# EAGLE schematic Principal_PCB (EAGLE 8.2.2)
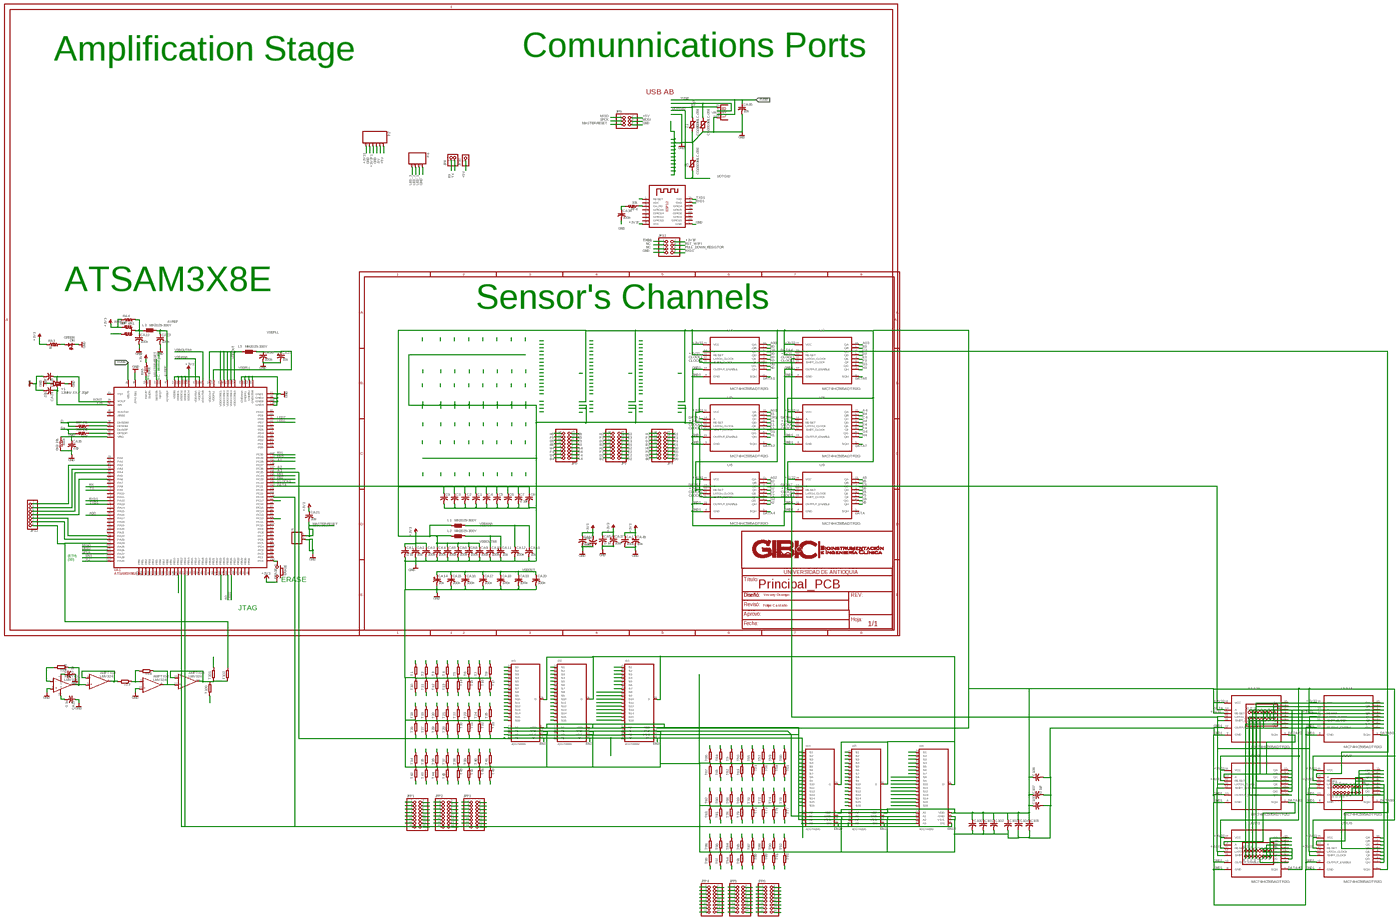
[diagram p0: schematic, sheet 1, overview]
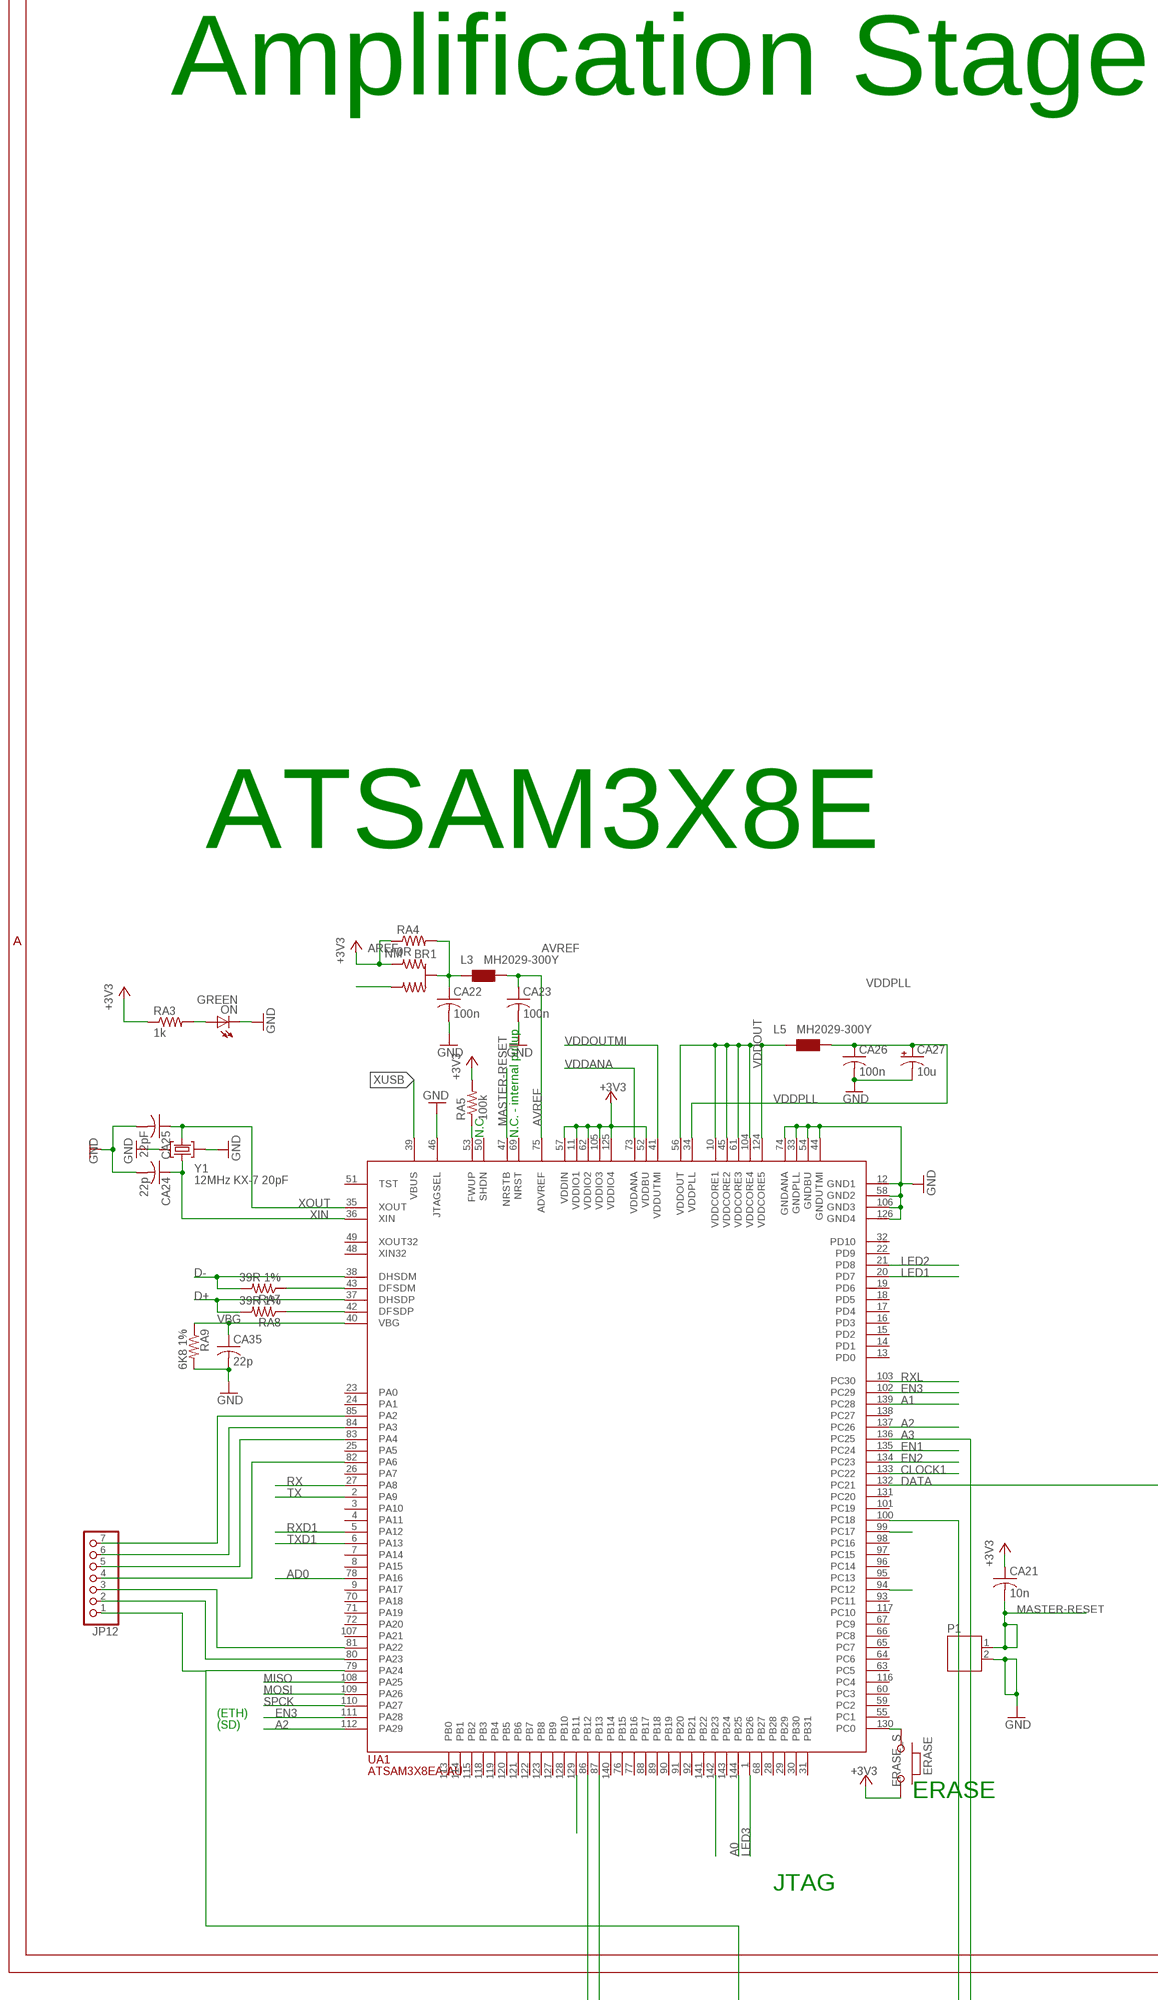
[diagram p1: schematic, sheet 1, part 1 of 6]
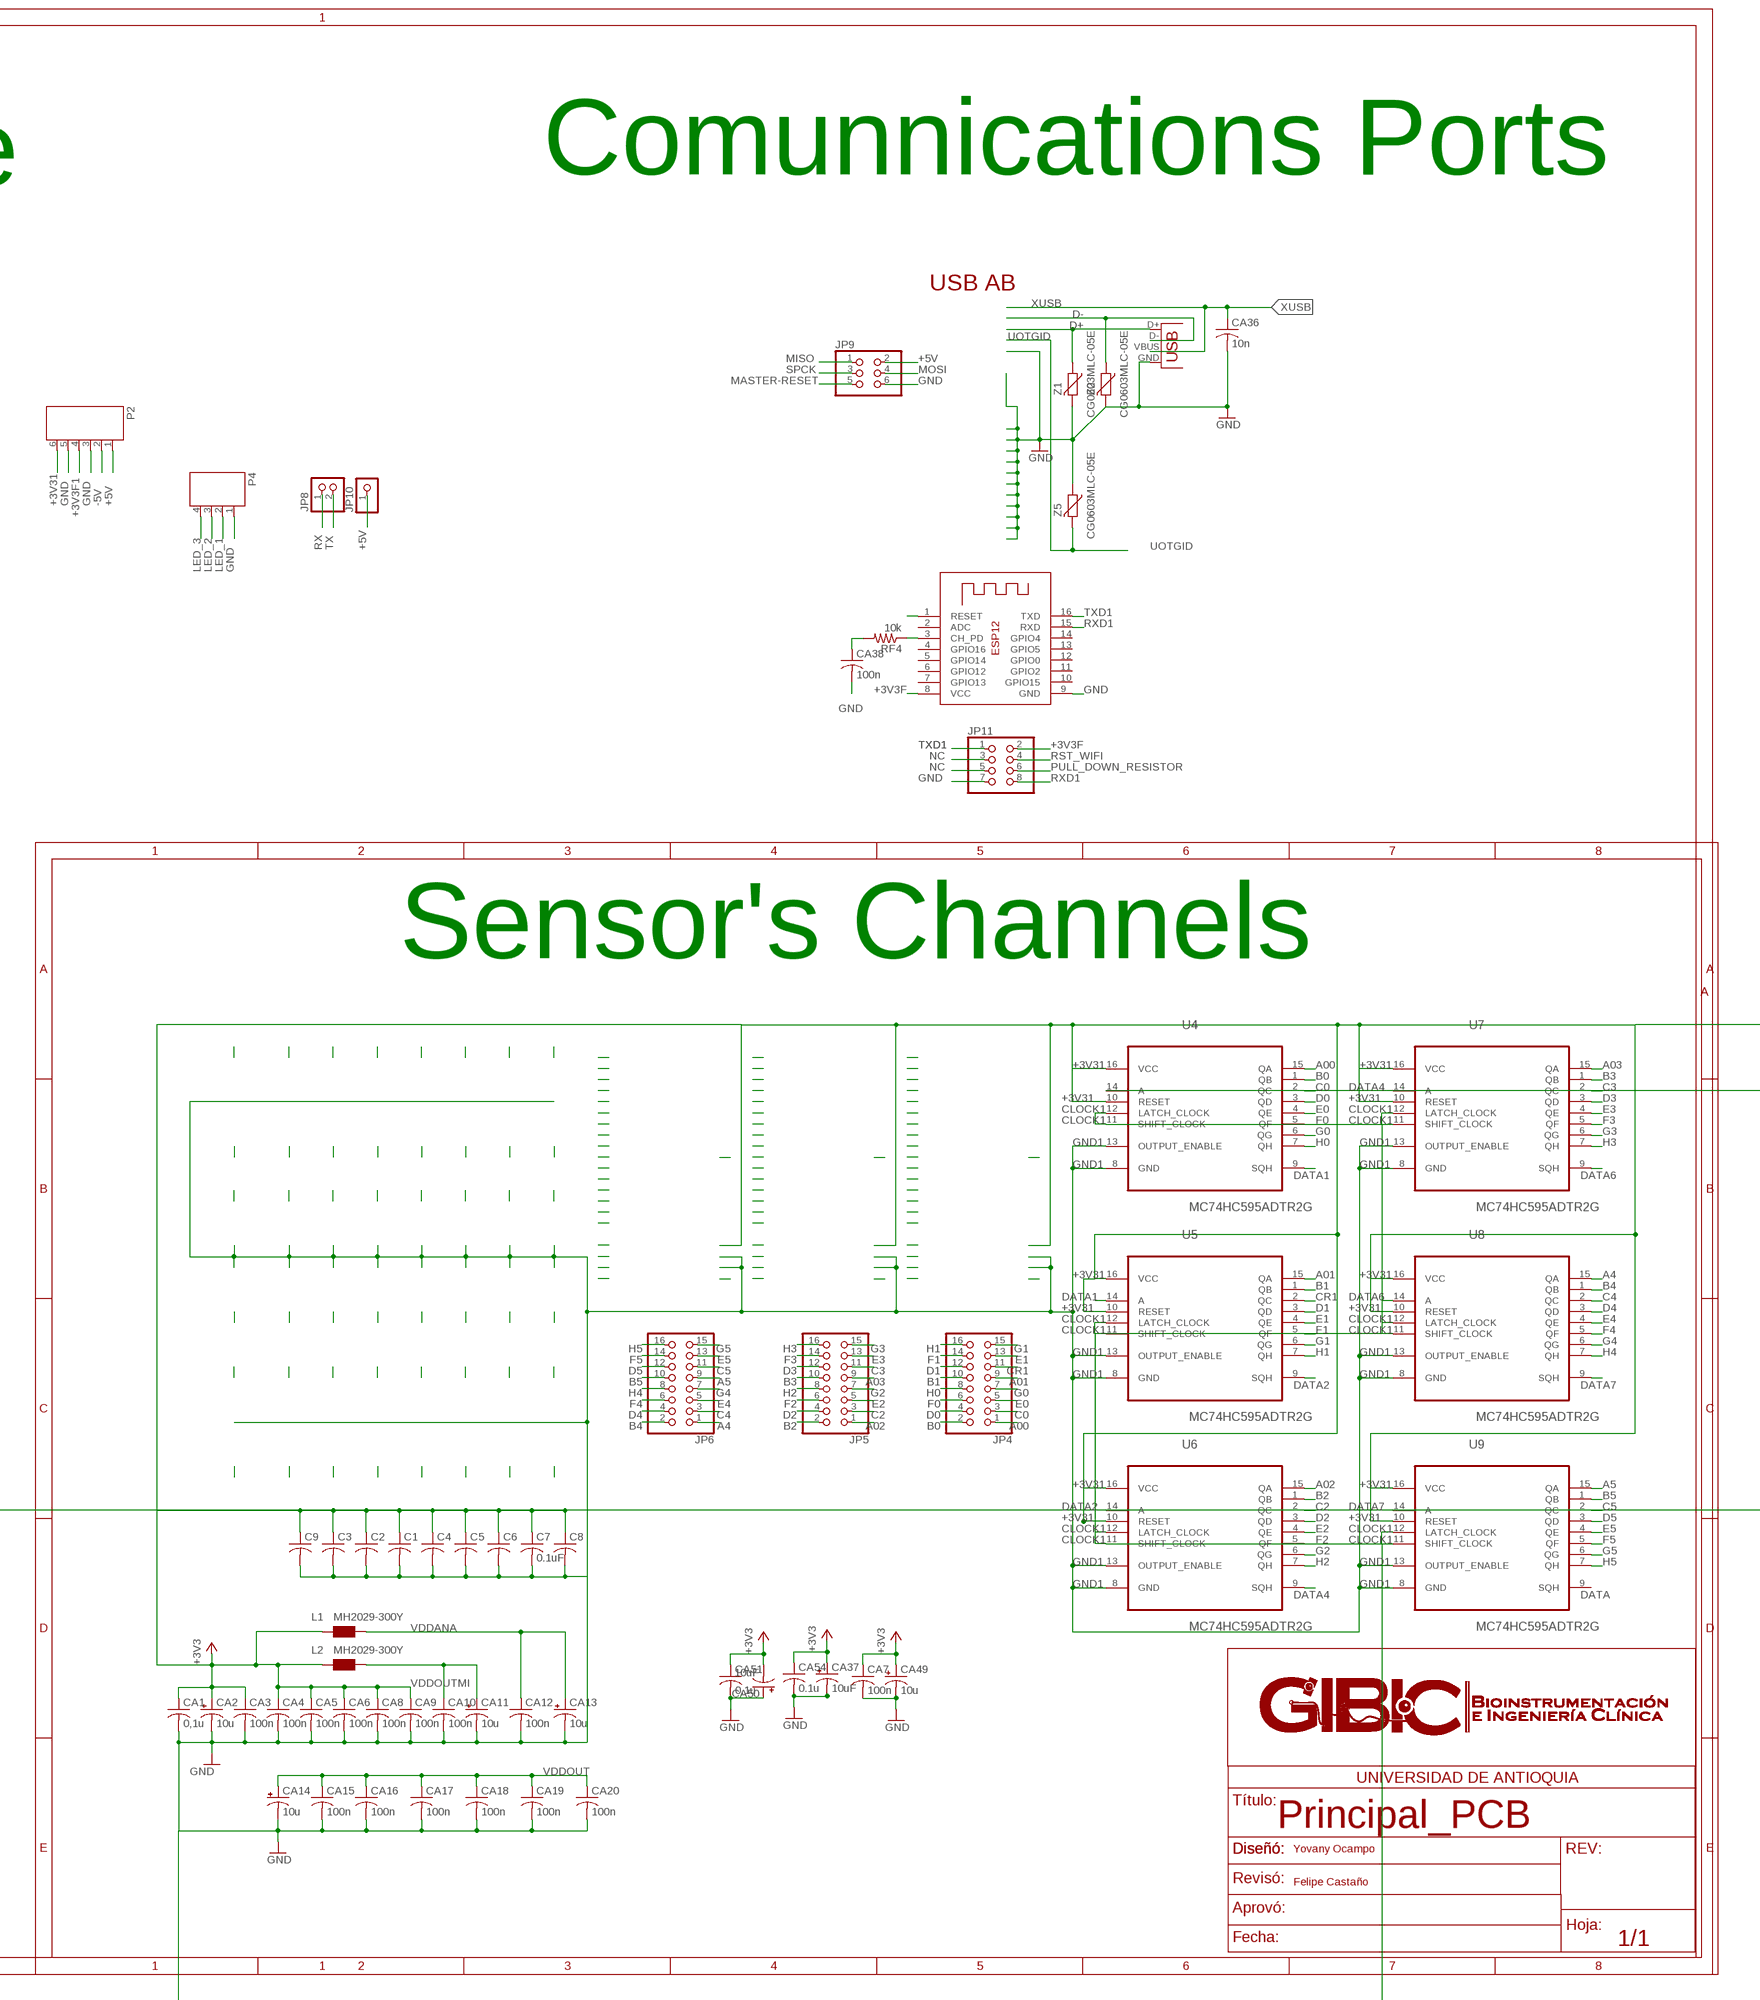
[diagram p2: schematic, sheet 1, part 2 of 6]
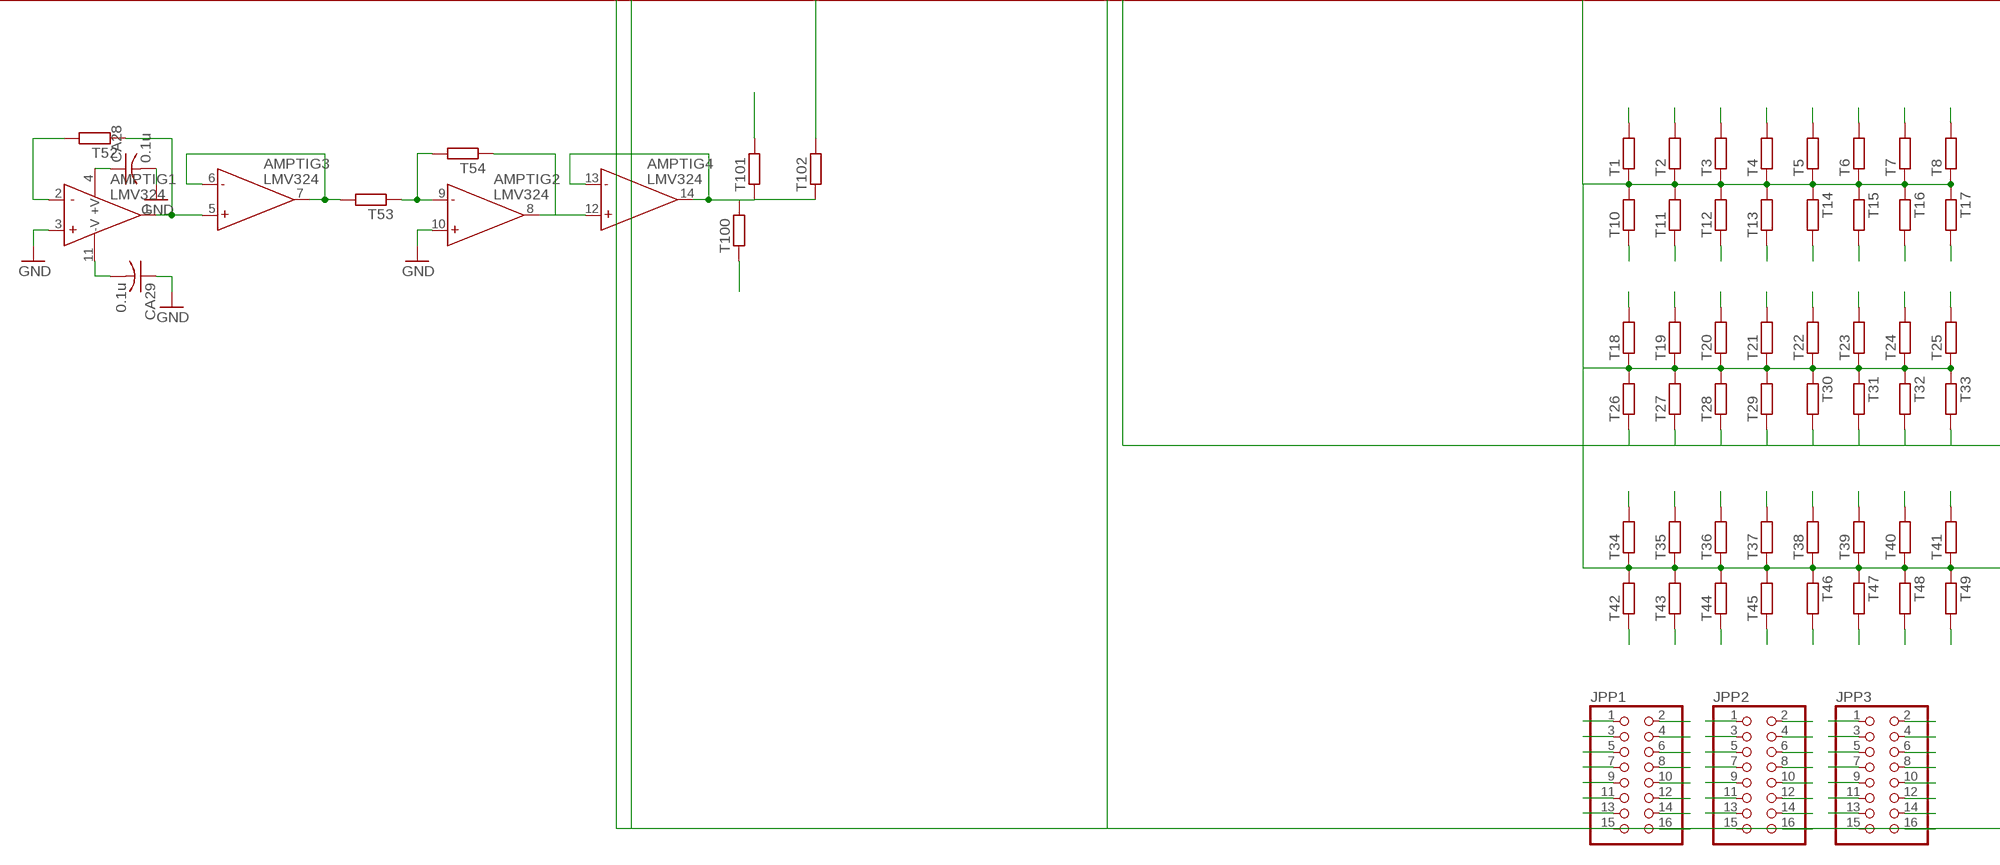
[diagram p3: schematic, sheet 1, part 3 of 6]
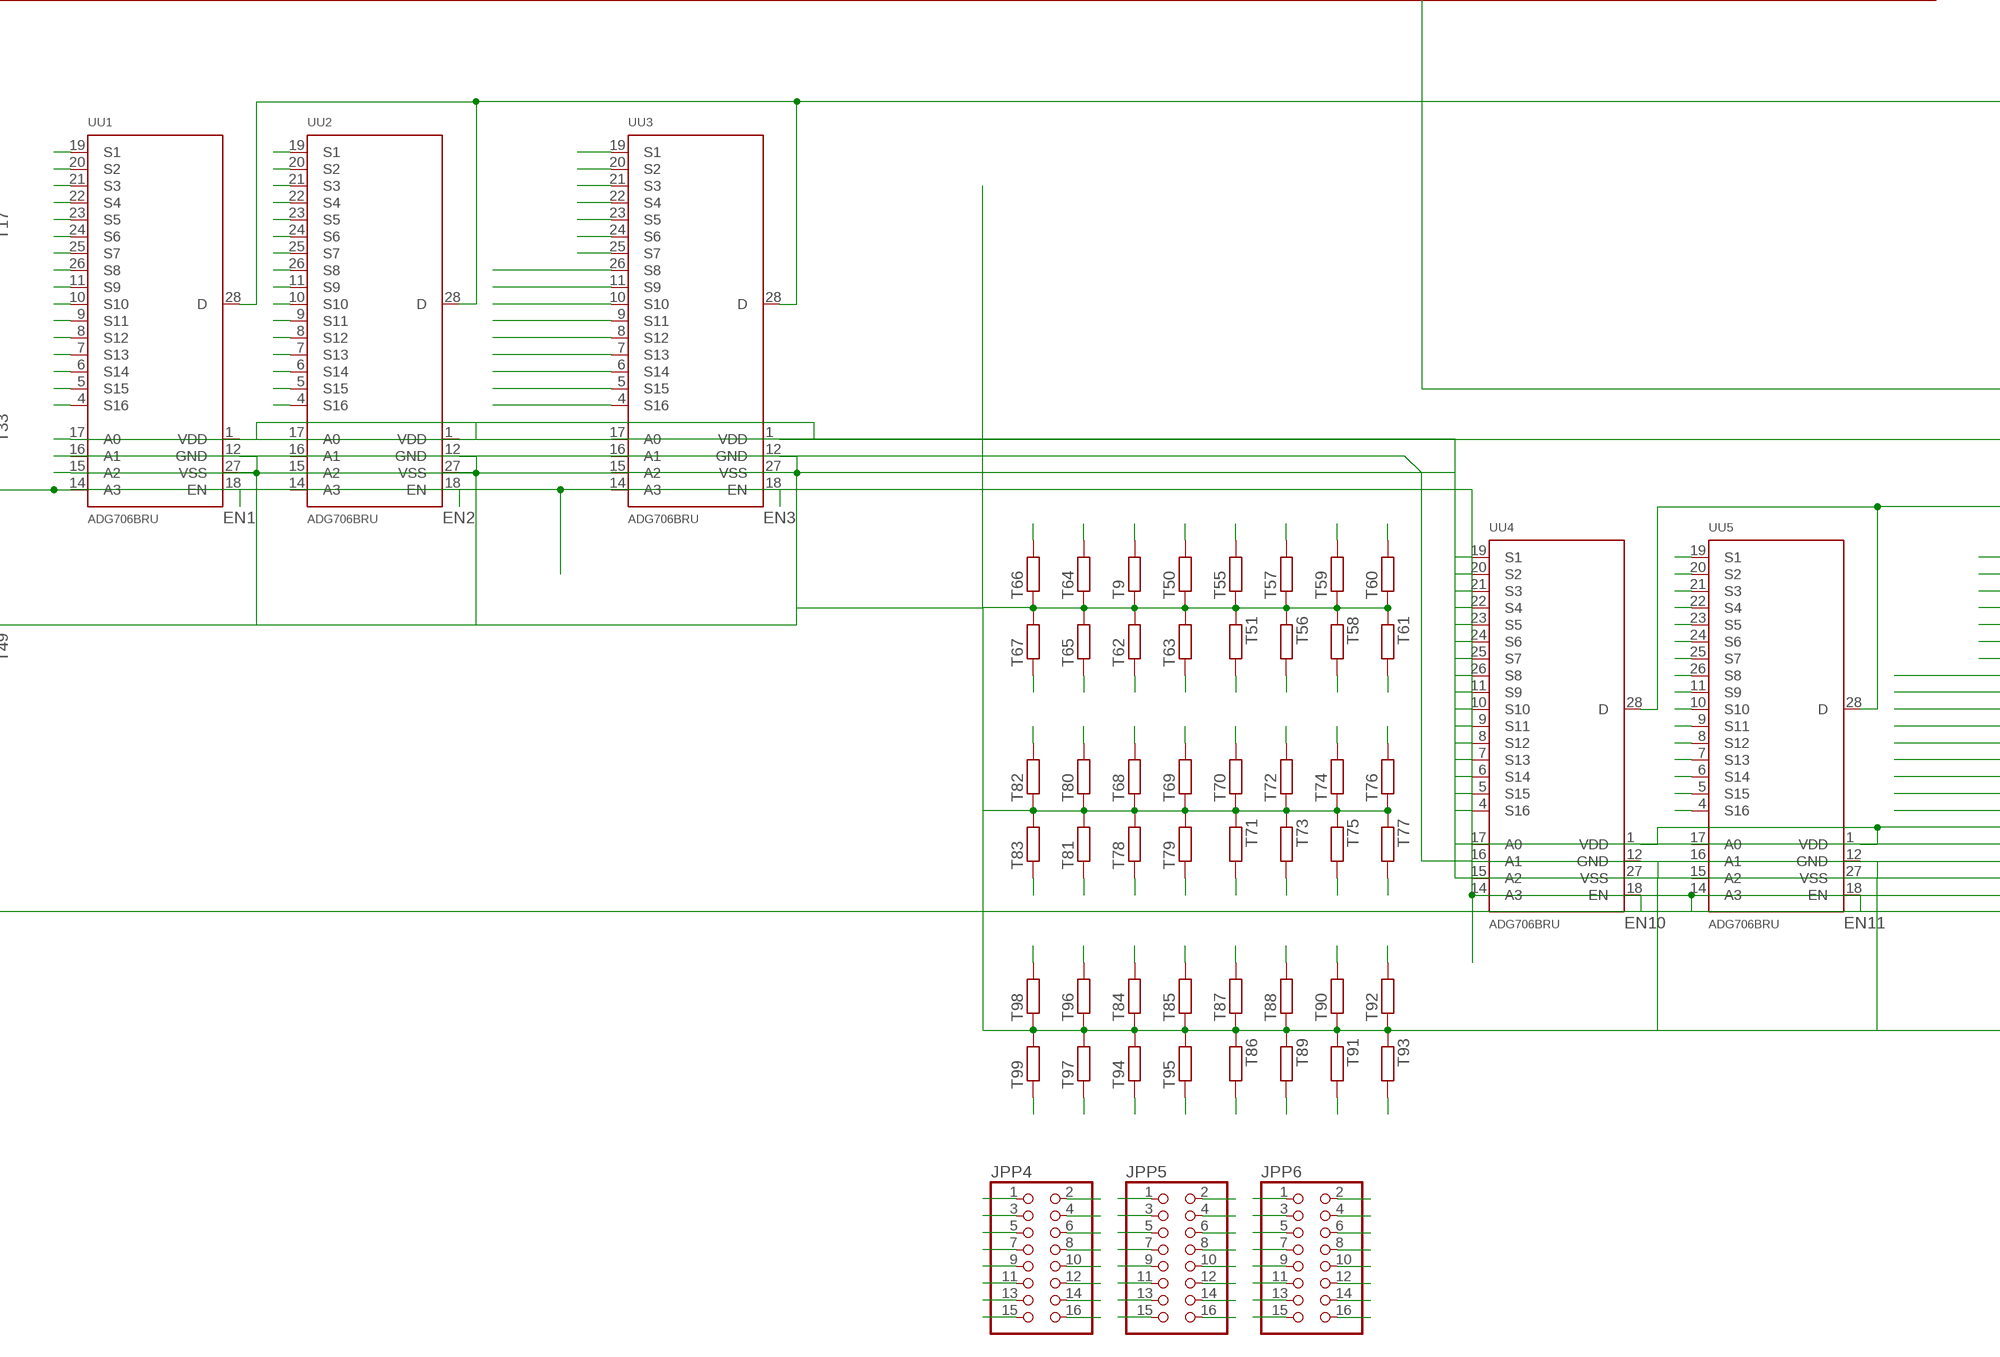
[diagram p4: schematic, sheet 1, part 4 of 6]
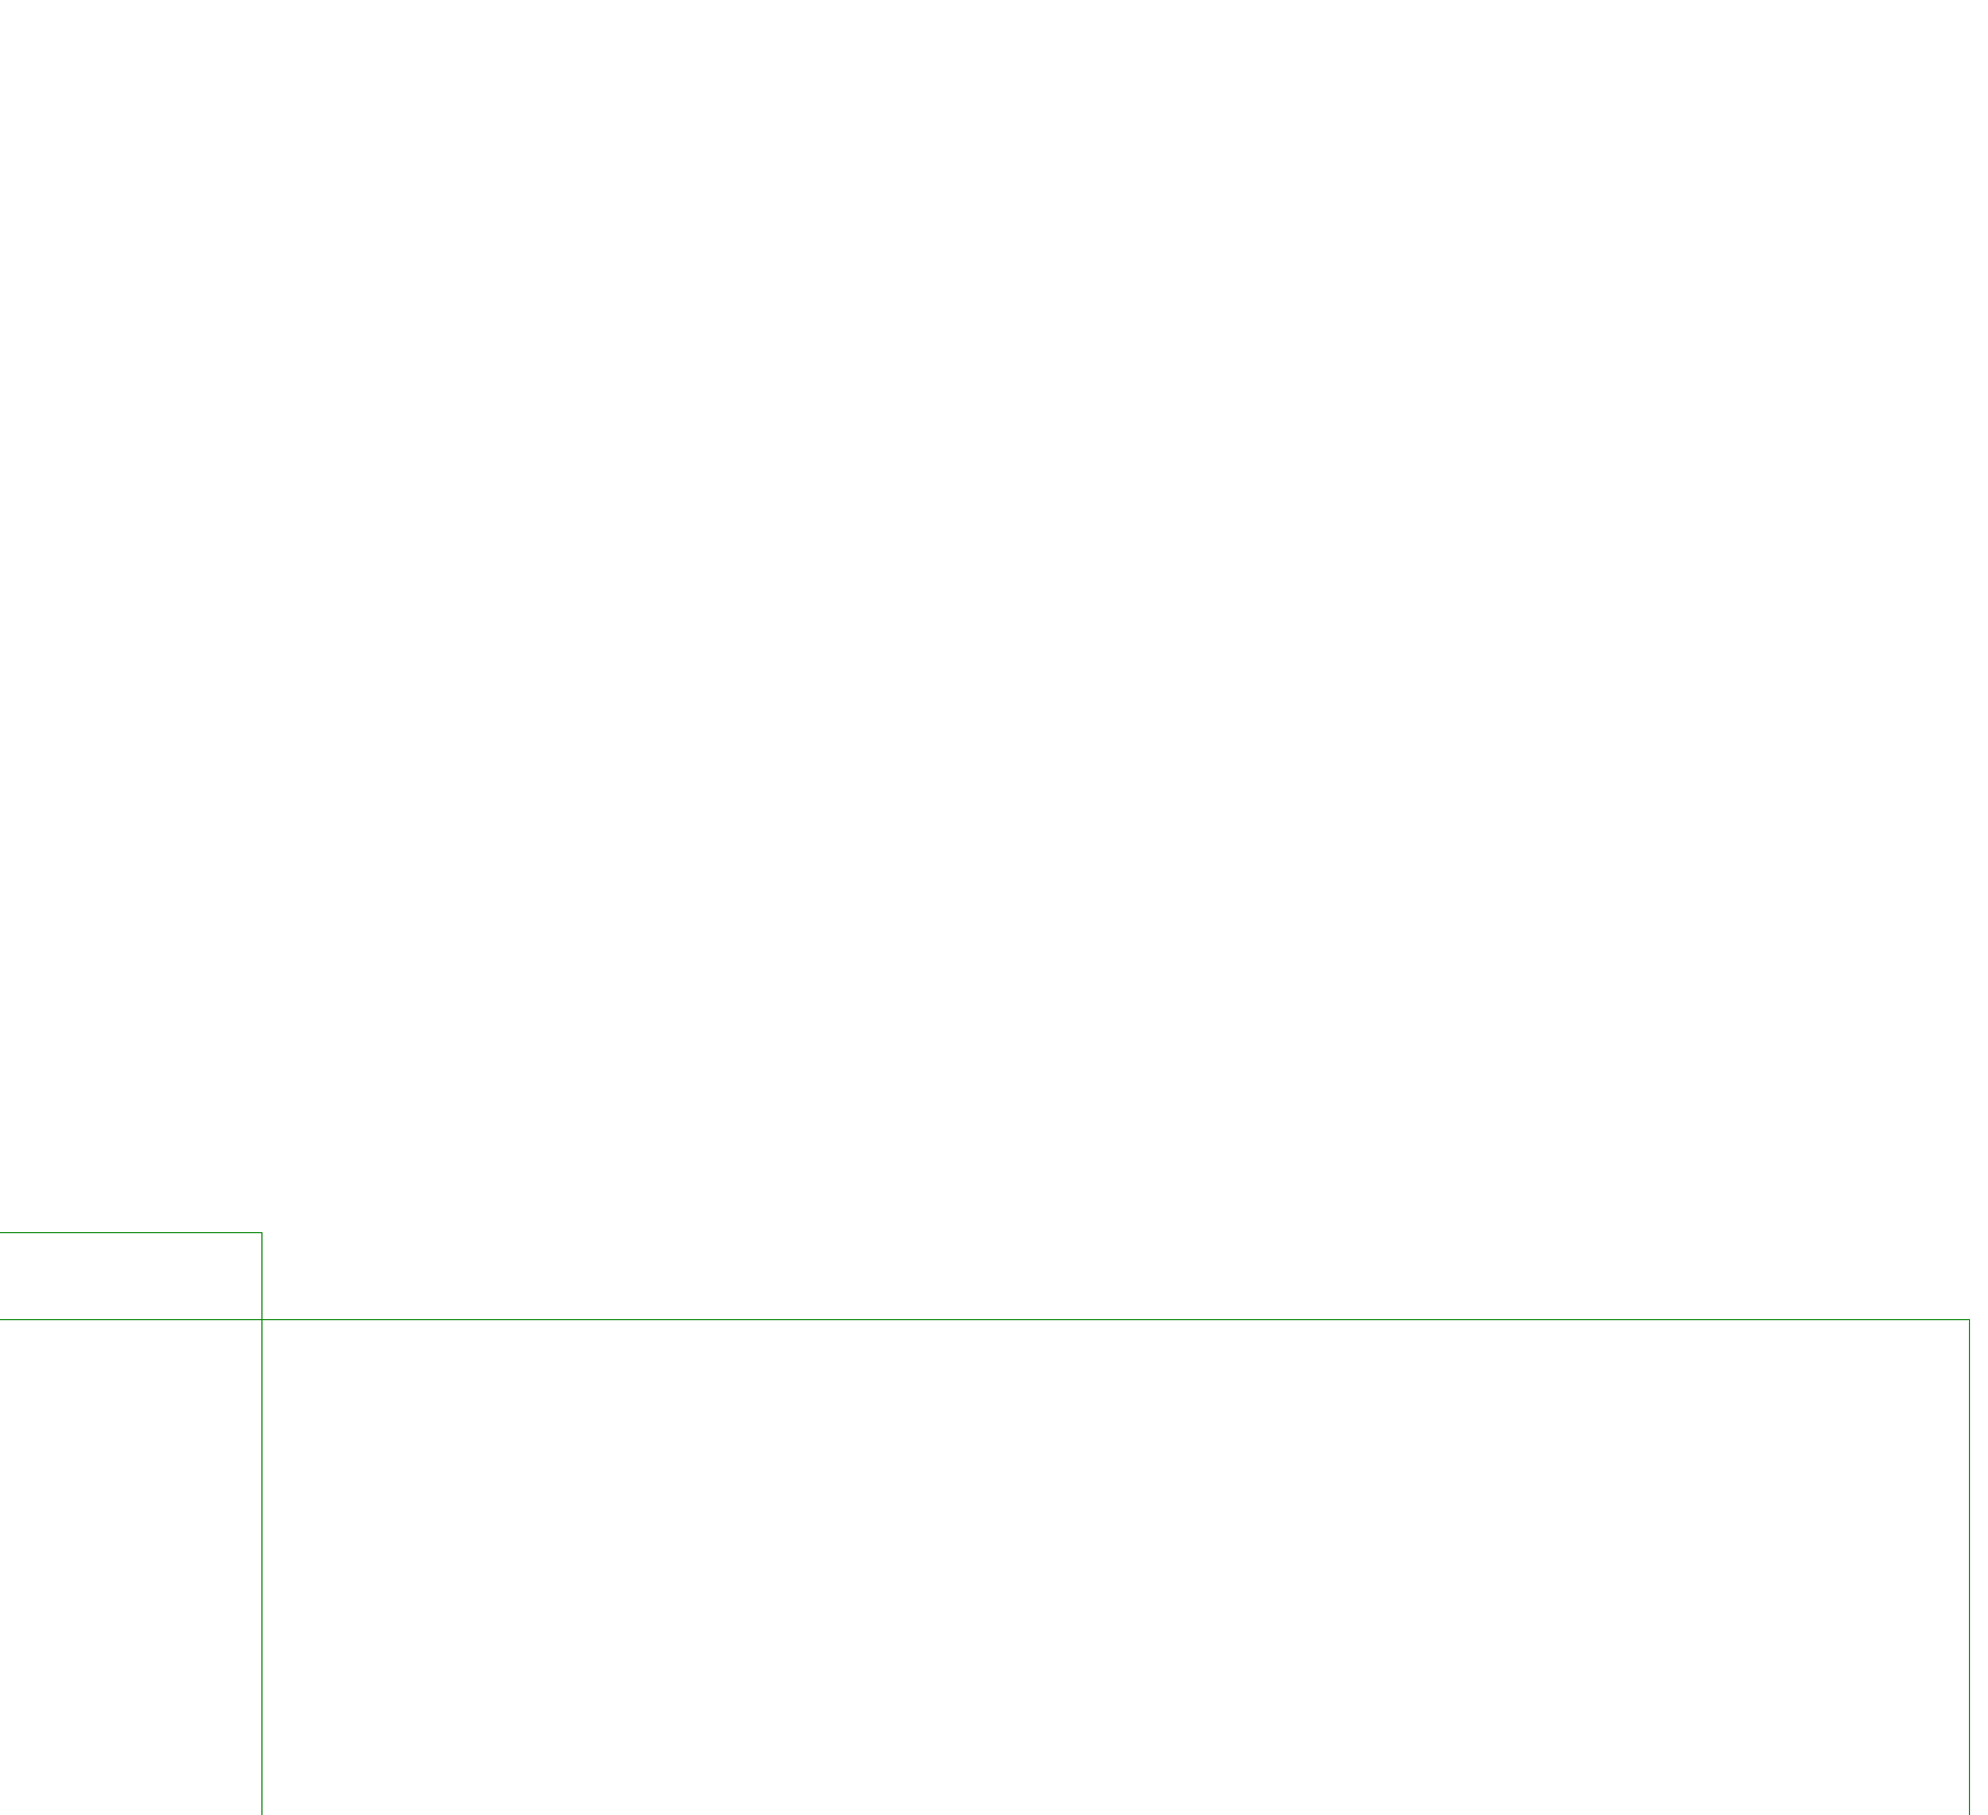
[diagram p5: schematic, sheet 1, part 5 of 6]
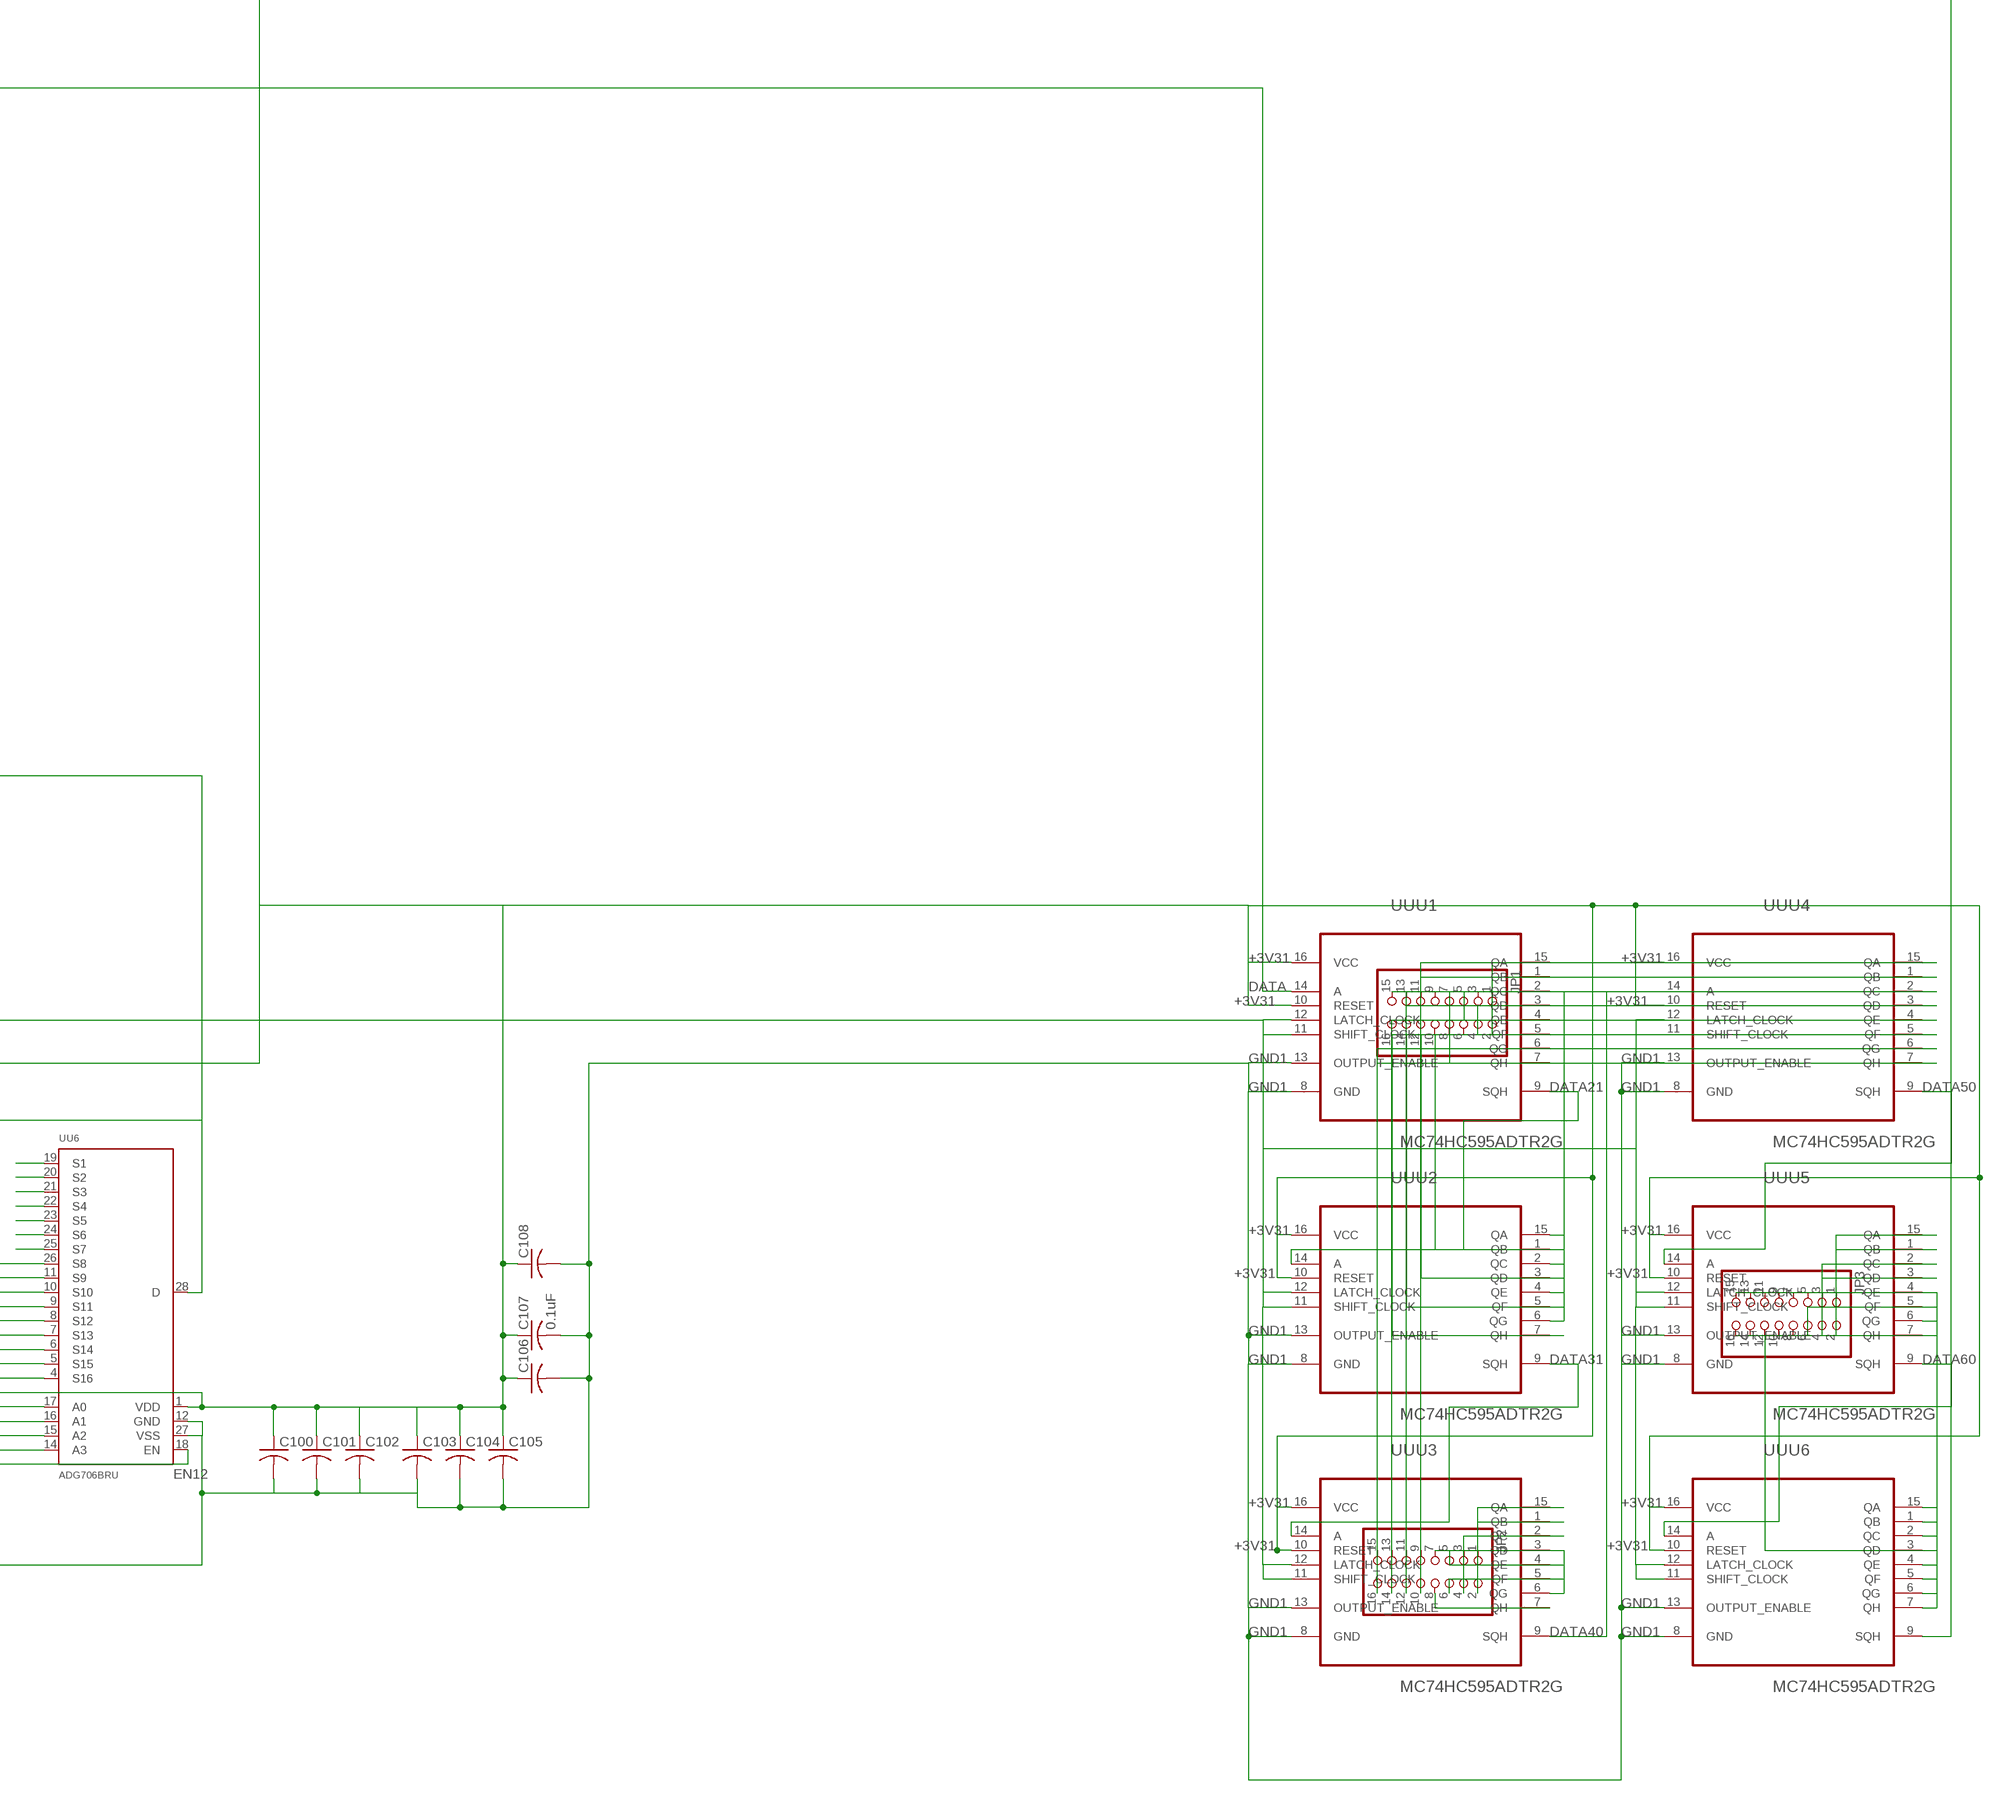
[diagram p6: schematic, sheet 1, part 6 of 6]

## Parts
AMPTI  LMV324  [SO014]
BR1  NM  J0402  [J0402]
C1  C-USC0805  [C0805]
C2  C-USC0805  [C0805]
C3  C-USC0805  [C0805]
C4  C-USC0805  [C0805]
C5  C-USC0805  [C0805]
C6  C-USC0805  [C0805]
C7  0.1uF  C-USC0805  [C0805]
C8  C-USC0805  [C0805]
C9  C-USC0805  [C0805]
C100  C-USC0805  [C0805]
C101  C-USC0805  [C0805]
C102  C-USC0805  [C0805]
C103  C-USC0805  [C0805]
C104  C-USC0805  [C0805]
C105  C-USC0805  [C0805]
C106  C-USC0805  [C0805]
C107  0.1uF  C-USC0805  [C0805]
C108  C-USC0805  [C0805]
CA1  0,1u  C-USC0805  [C0805]
CA2  10u  CPOL-USB/3528-21W  [B/3528-21W]
CA3  100n  C-USC0805  [C0805]
CA4  100n  C-USC0805  [C0805]
CA5  100n  C-USC0805  [C0805]
CA6  100n  C-USC0805  [C0805]
CA7  100n  C-USC0805  [C0805]
CA8  100n  C-USC0805  [C0805]
CA9  100n  C-USC0805  [C0805]
CA10  100n  C-USC0805  [C0805]
CA11  10u  CPOL-USB/3528-21W  [B/3528-21W]
CA12  100n  C-USC0805  [C0805]
CA13  10u  CPOL-USB/3528-21W  [B/3528-21W]
CA14  10u  CPOL-USB/3528-21W  [B/3528-21W]
CA15  100n  C-USC0805  [C0805]
CA16  100n  C-USC0805  [C0805]
CA17  100n  C-USC0805  [C0805]
CA18  100n  C-USC0805  [C0805]
CA19  100n  C-USC0805  [C0805]
CA20  100n  C-USC0805  [C0805]
CA21  10n  C-USC0805  [C0805]
CA22  100n  C-USC0805  [C0805]
CA23  100n  C-USC0805  [C0805]
CA24  22p  C-USC0805  [C0805]
CA25  22pF  C-USC0805  [C0805]
CA26  100n  C-USC0805  [C0805]
CA27  10u  CPOL-USB/3528-21W  [B/3528-21W]
CA28  0.1u  C-USC0805K  [C0805K]
CA29  0.1u  C-USC0805K  [C0805K]
CA35  22p  C-USC0805  [C0805]
CA36  10n  C-USC0805  [C0805]
CA37  10uF  CPOL-USB/3528-21W  [B/3528-21W]
CA38  100n  C-USC0805  [C0805]
CA49  10u  CPOL-USB/3528-21W  [B/3528-21W]
CA50  10uF  CPOL-USB/3528-21W  [B/3528-21W]
CA51  0.1u  C-USC0805K  [C0805K]
CA54  0.1u  C-USC0805K  [C0805K]
ERASE  MYSMD_PB157  [SMD_157SW]
JP1  PINHD-2X8  [2X08]
JP2  PINHD-2X8  [2X08]
JP3  PINHD-2X8  [2X08]
JP4  PINHD-2X8  [2X08]
JP5  PINHD-2X8  [2X08]
JP6  PINHD-2X8  [2X08]
JP8  PINHD-1X2  [1X02]
JP9  PINHD-2X3  [2X03]
JP10  PINHD-1X1  [1X01]
JP11  PINHD-2X4  [2X04]
JP12  PINHD-1X7  [1X07]
JPP1  PINHD-2X8  [2X08]
JPP2  PINHD-2X8  [2X08]
JPP3  PINHD-2X8  [2X08]
JPP4  PINHD-2X8  [2X08]
JPP5  PINHD-2X8  [2X08]
JPP6  PINHD-2X8  [2X08]
L1  MH2029-300Y  WE-CBF_0805  [0805]
L2  MH2029-300Y  WE-CBF_0805  [0805]
L3  MH2029-300Y  WE-CBF_0805  [0805]
L5  MH2029-300Y  WE-CBF_0805  [0805]
ON  GREEN  LEDCHIP-LED0805  [CHIP-LED0805]
P1  JST-PH2  [JST-PH2]
P2  JST-PH6  [JST-PH6]
P4  JST-PH4  [JST-PH4]
RA3  1k  R-US_R0805  [R0805]
RA4  0R  R-US_R0805  [R0805]
RA5  100k  R-US_R0805  [R0805]
RA7  39R 1%  R-US_R0805  [R0805]
RA8  39R 1%  R-US_R0805  [R0805]
RA9  6K8 1%  R-US_R0805  [R0805]
RF4  10k  R-US_R0805  [R0805]
T1  R-EU_R0805  [R0805]
T2  R-EU_R0805  [R0805]
T3  R-EU_R0805  [R0805]
T4  R-EU_R0805  [R0805]
T5  R-EU_R0805  [R0805]
T6  R-EU_R0805  [R0805]
T7  R-EU_R0805  [R0805]
T8  R-EU_R0805  [R0805]
T9  R-EU_R0805  [R0805]
T10  R-EU_R0805  [R0805]
T11  R-EU_R0805  [R0805]
T12  R-EU_R0805  [R0805]
T13  R-EU_R0805  [R0805]
T14  R-EU_R0805  [R0805]
T15  R-EU_R0805  [R0805]
T16  R-EU_R0805  [R0805]
T17  R-EU_R0805  [R0805]
T18  R-EU_R0805  [R0805]
T19  R-EU_R0805  [R0805]
T20  R-EU_R0805  [R0805]
T21  R-EU_R0805  [R0805]
T22  R-EU_R0805  [R0805]
T23  R-EU_R0805  [R0805]
T24  R-EU_R0805  [R0805]
T25  R-EU_R0805  [R0805]
T26  R-EU_R0805  [R0805]
T27  R-EU_R0805  [R0805]
T28  R-EU_R0805  [R0805]
T29  R-EU_R0805  [R0805]
T30  R-EU_R0805  [R0805]
T31  R-EU_R0805  [R0805]
T32  R-EU_R0805  [R0805]
T33  R-EU_R0805  [R0805]
T34  R-EU_R0805  [R0805]
T35  R-EU_R0805  [R0805]
T36  R-EU_R0805  [R0805]
T37  R-EU_R0805  [R0805]
T38  R-EU_R0805  [R0805]
T39  R-EU_R0805  [R0805]
T40  R-EU_R0805  [R0805]
T41  R-EU_R0805  [R0805]
T42  R-EU_R0805  [R0805]
T43  R-EU_R0805  [R0805]
T44  R-EU_R0805  [R0805]
T45  R-EU_R0805  [R0805]
T46  R-EU_R0805  [R0805]
T47  R-EU_R0805  [R0805]
T48  R-EU_R0805  [R0805]
T49  R-EU_R0805  [R0805]
T50  R-EU_R0805  [R0805]
T51  R-EU_R0805  [R0805]
T52  R-EU_R0805  [R0805]
T53  R-EU_R0805  [R0805]
T54  R-EU_R0805  [R0805]
T55  R-EU_R0805  [R0805]
T56  R-EU_R0805  [R0805]
T57  R-EU_R0805  [R0805]
T58  R-EU_R0805  [R0805]
T59  R-EU_R0805  [R0805]
T60  R-EU_R0805  [R0805]
T61  R-EU_R0805  [R0805]
T62  R-EU_R0805  [R0805]
T63  R-EU_R0805  [R0805]
T64  R-EU_R0805  [R0805]
T65  R-EU_R0805  [R0805]
T66  R-EU_R0805  [R0805]
T67  R-EU_R0805  [R0805]
T68  R-EU_R0805  [R0805]
T69  R-EU_R0805  [R0805]
T70  R-EU_R0805  [R0805]
T71  R-EU_R0805  [R0805]
T72  R-EU_R0805  [R0805]
T73  R-EU_R0805  [R0805]
T74  R-EU_R0805  [R0805]
T75  R-EU_R0805  [R0805]
T76  R-EU_R0805  [R0805]
T77  R-EU_R0805  [R0805]
T78  R-EU_R0805  [R0805]
T79  R-EU_R0805  [R0805]
T80  R-EU_R0805  [R0805]
T81  R-EU_R0805  [R0805]
T82  R-EU_R0805  [R0805]
T83  R-EU_R0805  [R0805]
T84  R-EU_R0805  [R0805]
T85  R-EU_R0805  [R0805]
T86  R-EU_R0805  [R0805]
T87  R-EU_R0805  [R0805]
T88  R-EU_R0805  [R0805]
T89  R-EU_R0805  [R0805]
T90  R-EU_R0805  [R0805]
T91  R-EU_R0805  [R0805]
T92  R-EU_R0805  [R0805]
T93  R-EU_R0805  [R0805]
T94  R-EU_R0805  [R0805]
T95  R-EU_R0805  [R0805]
T96  R-EU_R0805  [R0805]
T97  R-EU_R0805  [R0805]
T98  R-EU_R0805  [R0805]
T99  R-EU_R0805  [R0805]
T100  R-EU_R0805  [R0805]
T101  R-EU_R0805  [R0805]
T102  R-EU_R0805  [R0805]
U4  MC74HC595ADTR2G  [SOP65P640X120-16N]
U5  MC74HC595ADTR2G  [SOP65P640X120-16N]
U6  MC74HC595ADTR2G  [SOP65P640X120-16N]
U7  MC74HC595ADTR2G  [SOP65P640X120-16N]
U8  MC74HC595ADTR2G  [SOP65P640X120-16N]
U9  MC74HC595ADTR2G  [SOP65P640X120-16N]
UA1  ATSAM3X8EA-AU  ATSAM3X/AAU  [LQFP144]
UU1  ADG706BRU  [TSSOP28]
UU2  ADG706BRU  [TSSOP28]
UU3  ADG706BRU  [TSSOP28]
UU4  ADG706BRU  [TSSOP28]
UU5  ADG706BRU  [TSSOP28]
UU6  ADG706BRU  [TSSOP28]
UUU1  MC74HC595ADTR2G  [SOP65P640X120-16N]
UUU2  MC74HC595ADTR2G  [SOP65P640X120-16N]
UUU3  MC74HC595ADTR2G  [SOP65P640X120-16N]
UUU4  MC74HC595ADTR2G  [SOP65P640X120-16N]
UUU5  MC74HC595ADTR2G  [SOP65P640X120-16N]
UUU6  MC74HC595ADTR2G  [SOP65P640X120-16N]
X1  ESP-12  [ESP-12]
X3  USBPTH  [USB-B-PTH]
Y1  12MHz KX-7 20pF  CRYSTAL-3.2-2.5  [CRYSTAL-3.2-2.5]
Z1  CG0603MLC-05E  VARISTORCN0603  [CT/CN0603]
Z2  CG0603MLC-05E  VARISTORCN0603  [CT/CN0603]
Z5  CG0603MLC-05E  VARISTORCN0603  [CT/CN0603]

## Nets
49: JPP4.15 T64.2 UU4.20(S2)
50: JPP4.16 T66.2 UU4.19(S1)
51: JPP4.14 T9.2 UU4.21(S3)
52: JPP4.12 T51.2 UU4.23(S5)
53: JPP4.11 T55.2 UU4.24(S6)
54: JPP4.10 T56.2 UU4.25(S7)
55: JPP4.9 T57.2 UU4.26(S8)
56: JPP4.7 T59.2 UU4.10(S10)
57: JPP4.8 T58.2 UU4.11(S9)
58: JPP4.5 T61.2 UU4.8(S12)
59: JPP4.6 T60.2 UU4.9(S11)
60: JPP4.3 T65.1 UU4.6(S14)
61: JPP4.4 T67.1 UU4.7(S13)
62: JPP4.1 T63.1 UU4.4(S16)
63: JPP4.2 T62.1 UU4.5(S15)
64: JPP4.13 T50.2 UU4.22(S4)
65: JPP5.15 T80.2 UU5.20(S2)
66: JPP5.16 T82.2 UU5.19(S1)
67: JPP5.14 T68.2 UU5.21(S3)
68: JPP5.12 T70.2 UU5.23(S5)
69: JPP5.11 T71.2 UU5.24(S6)
70: JPP5.10 T72.2 UU5.25(S7)
71: JPP5.9 T73.2 UU5.26(S8)
72: JPP5.7 T75.2 UU5.10(S10)
73: JPP5.8 T74.2 UU5.11(S9)
74: JPP5.5 T77.2 UU5.8(S12)
75: JPP5.6 T76.2 UU5.9(S11)
76: JPP5.3 T81.1 UU5.6(S14)
77: JPP5.4 T83.1 UU5.7(S13)
78: JPP5.1 T79.1 UU5.4(S16)
79: JPP5.2 T78.1 UU5.5(S15)
80: JPP5.13 T69.2 UU5.22(S4)
81: JPP6.15 T96.2 UU6.20(S2)
82: JPP6.16 T98.2 UU6.19(S1)
83: JPP6.14 T84.2 UU6.21(S3)
84: JPP6.12 T86.2 UU6.23(S5)
85: JPP6.11 T87.2 UU6.24(S6)
86: JPP6.10 T88.2 UU6.25(S7)
87: JPP6.9 T89.2 UU6.26(S8)
88: JPP6.7 T91.2 UU6.10(S10)
89: JPP6.8 T90.2 UU6.11(S9)
90: JPP6.5 T93.2 UU6.8(S12)
91: JPP6.6 T92.2 UU6.9(S11)
92: JPP6.3 T97.1 UU6.6(S14)
93: JPP6.4 T99.1 UU6.7(S13)
94: JPP6.1 T95.1 UU6.4(S16)
95: JPP6.2 T94.1 UU6.5(S15)
96: JPP6.13 T85.2 UU6.22(S4)
100: JPP1.16 T1.2 UU1.19(S1)
101: JPP1.15 T2.2 UU1.20(S2)
102: JPP1.14 T3.2 UU1.21(S3)
103: JPP1.13 T4.2 UU1.22(S4)
104: JPP1.11 T5.2 UU1.24(S6)
105: JPP1.9 T6.2 UU1.26(S8)
106: JPP1.7 T7.2 UU1.10(S10)
107: JPP1.6 T8.2 UU1.9(S11)
108: JPP1.4 T10.1 UU1.7(S13)
109: JPP1.3 T11.1 UU1.6(S14)
110: JPP1.2 T12.1 UU1.5(S15)
111: JPP1.1 T13.1 UU1.4(S16)
112: JPP1.12 T14.2 UU1.23(S5)
113: JPP1.10 T15.2 UU1.25(S7)
114: JPP1.8 T16.2 UU1.11(S9)
115: JPP1.5 T17.2 UU1.8(S12)
116: JPP2.16 T18.2 UU2.19(S1)
117: JPP2.15 T19.2 UU2.20(S2)
118: JPP2.14 T20.2 UU2.21(S3)
119: JPP2.13 T21.2 UU2.22(S4)
120: JPP2.12 T22.2 UU2.23(S5)
121: JPP2.10 T23.2 UU2.25(S7)
122: JPP2.8 T24.2 UU2.11(S9)
123: JPP2.6 T25.2 UU2.9(S11)
124: JPP2.4 T26.1 UU2.7(S13)
125: JPP2.3 T27.1 UU2.6(S14)
126: JPP2.2 T28.1 UU2.5(S15)
127: JPP2.1 T29.1 UU2.4(S16)
128: JPP2.11 T30.2 UU2.24(S6)
129: JPP2.9 T31.2 UU2.26(S8)
130: JPP2.7 T32.2 UU2.10(S10)
131: JPP2.5 T33.2 UU2.8(S12)
132: JPP3.16 T34.2 UU3.19(S1)
133: JPP3.15 T35.2 UU3.20(S2)
134: JPP3.14 T36.2 UU3.21(S3)
135: JPP3.13 T37.2 UU3.22(S4)
136: JPP3.11 T38.2 UU3.24(S6)
137: JPP3.10 T39.2 UU3.25(S7)
138: JPP3.8 T40.2 UU3.11(S9)
139: JPP3.6 T41.2 UU3.9(S11)
140: JPP3.4 T42.1 UU3.7(S13)
141: JPP3.3 T43.1 UU3.6(S14)
142: JPP3.2 T44.1 UU3.5(S15)
143: JPP3.1 T45.1 UU3.4(S16)
144: JPP3.12 T46.2 UU3.23(S5)
145: JPP3.9 T47.2 UU3.26(S8)
146: JPP3.7 T48.2 UU3.10(S10)
147: JPP3.5 T49.2 UU3.8(S12)
+3V3F1: CA7.1 CA38.1 CA49.+ JP11.2 P2.4 RF4.2 X1.8(VCC) ; supply symbol labelled +3V3
+3V31: AMPTI.4(+V) BR1.3 C1.1 C2.1 C3.1 C4.1 C5.1 C6.1 C7.1 C8.1 C9.1 C100.1 C101.1 C102.1 C103.1 C104.1 C105.1 C106.1 C107.1 C108.1 CA1.1 CA2.+ CA3.1 CA4.1 CA5.1 CA6.1 CA8.1 CA9.1 CA21.1 CA28.1 ERASE.1 JP9.2 L1.1 L2.1 P2.6 RA3.1 RA4.1 RA5.2 U4.10(RESET) U4.16(VCC) U5.10(RESET) U5.16(VCC) U6.10(RESET) U6.16(VCC) U7.10(RESET) U7.16(VCC) U8.10(RESET) U8.16(VCC) U9.10(RESET) U9.16(VCC) UA1.11(VDDIO1) UA1.52(VDDBU) UA1.57(VDDIN) UA1.62(VDDIO2) UA1.105(VDDIO3) UA1.125(VDDIO4) UU1.1(VDD) UU2.1(VDD) UU3.1(VDD) UU4.1(VDD) UU5.1(VDD) UU6.1(VDD) UUU1.10(RESET) UUU1.16(VCC) UUU2.10(RESET) UUU2.16(VCC) UUU3.10(RESET) UUU3.16(VCC) UUU4.10(RESET) UUU4.16(VCC) UUU5.10(RESET) UUU5.16(VCC) UUU6.10(RESET) UUU6.16(VCC) ; supply symbol labelled +3V3
+5V: CA37.+ CA54.1 JP10.1 P2.1 ; supply symbol labelled +3V3
-5V: AMPTI.11(-V) CA29.2 CA50.- CA51.1 P2.2 ; supply symbol labelled +3V3
A0: UA1.144(PB25) UU1.17(A0) UU2.17(A0) UU3.17(A0) UU4.17(A0) UU5.17(A0) UU6.17(A0)
A00: JP4.1 U4.15(QA)
A1: UA1.139(PC28) UU1.16(A1) UU2.16(A1) UU3.16(A1) UU4.16(A1) UU5.16(A1) UU6.16(A1)
A01: JP4.9 U5.15(QA)
A2: UA1.112(PA29) UA1.137(PC26) UU1.15(A2) UU2.15(A2) UU3.15(A2) UU4.15(A2) UU5.15(A2) UU6.15(A2)
A02: JP5.1 U6.15(QA)
A3: UA1.136(PC25) UU1.14(A3) UU2.14(A3) UU3.14(A3) UU4.14(A3) UU5.14(A3) UU6.14(A3)
A03: JP5.9 U7.15(QA)
A4: JP6.1 U8.15(QA)
A5: JP6.9 U9.15(QA)
AD0: UA1.78(PA16)
AREF: BR1.1
AVREF: CA23.1 L3.2 UA1.75(ADVREF)
AVREFL: BR1.2(C) CA22.1 L3.1 RA4.2
B0: JP4.2 U4.1(QB)
B1: JP4.10 U5.1(QB)
B2: JP5.2 U6.1(QB)
B3: JP5.10 U7.1(QB)
B4: JP6.2 U8.1(QB)
B5: JP6.10 U9.1(QB)
C0: JP4.3 U4.2(QC)
C2: JP5.3 U6.2(QC)
C3: JP5.11 U7.2(QC)
C4: JP6.3 U8.2(QC)
C5: JP6.11 U9.2(QC)
CLOCK1: U4.11(SHIFT_CLOCK) U4.12(LATCH_CLOCK) U5.11(SHIFT_CLOCK) U5.12(LATCH_CLOCK) U6.11(SHIFT_CLOCK) U6.12(LATCH_CLOCK) U7.11(SHIFT_CLOCK) U7.12(LATCH_CLOCK) U8.11(SHIFT_CLOCK) U8.12(LATCH_CLOCK) U9.11(SHIFT_CLOCK) U9.12(LATCH_CLOCK) UA1.133(PC22) UUU1.11(SHIFT_CLOCK) UUU1.12(LATCH_CLOCK) UUU2.11(SHIFT_CLOCK) UUU2.12(LATCH_CLOCK) UUU3.11(SHIFT_CLOCK) UUU3.12(LATCH_CLOCK) UUU4.11(SHIFT_CLOCK) UUU4.12(LATCH_CLOCK) UUU5.11(SHIFT_CLOCK) UUU5.12(LATCH_CLOCK) UUU6.11(SHIFT_CLOCK) UUU6.12(LATCH_CLOCK)
CR1: JP4.11 U5.2(QC)
D0: JP4.4 U4.3(QD)
D1: JP4.12 U5.3(QD)
D2: JP5.4 U6.3(QD)
D3: JP5.12 U7.3(QD)
D4: JP6.4 U8.3(QD)
D5: JP6.12 U9.3(QD)
D+ [USBpair]: RA8.2 UA1.37(DHSDP) X3.D+ Z1.1
D- [USBpair]: RA7.2 UA1.38(DHSDM) X3.D- Z2.1
DATA: UA1.132(PC21) UUU1.14(A)
DATA1: U4.9(SQH) U5.14(A)
DATA2: U5.9(SQH) U6.14(A)
DATA4: U6.9(SQH) U7.14(A)
DATA6: U7.9(SQH) U8.14(A)
DATA7: U8.9(SQH) U9.14(A)
DATA13: U4.14(A) UUU6.9(SQH)
DATA21: UUU1.9(SQH) UUU2.14(A)
DATA31: UUU2.9(SQH) UUU3.14(A)
DATA40: UUU3.9(SQH) UUU4.14(A)
DATA50: UUU4.9(SQH) UUU5.14(A)
DATA60: UUU5.9(SQH) UUU6.14(A)
E0: JP4.5 U4.4(QE)
E1: JP4.13 U5.4(QE)
E2: JP5.5 U6.4(QE)
E3: JP5.13 U7.4(QE)
E4: JP6.5 U8.4(QE)
E5: JP6.13 U9.4(QE)
EN1: UA1.135(PC24) UU1.18(EN)
EN2: UA1.134(PC23) UU2.18(EN)
EN3: UA1.102(PC29) UA1.111(PA28) UU3.18(EN)
EN10: UA1.100(PC18) UU4.18(EN)
EN11: UA1.87(PB13) UU5.18(EN)
EN12: UA1.86(PB12) UU6.18(EN)
ERASE_S: ERASE.2 UA1.130(PC0)
F0: JP4.6 U4.5(QF)
F1: JP4.14 U5.5(QF)
F2: JP5.6 U6.5(QF)
F3: JP5.14 U7.5(QF)
F4: JP6.6 U8.5(QF)
F5: JP6.14 U9.5(QF)
G0: JP4.7 U4.6(QG)
G1: JP4.15 U5.6(QG)
G2: JP5.7 U6.6(QG)
G3: JP5.15 U7.6(QG)
G4: JP6.7 U8.6(QG)
G5: JP6.15 U9.6(QG)
GND: CA28.2 CA29.1
GND1: AMPTI.3(+IN) AMPTI.10(+IN) C1.2 C2.2 C3.2 C4.2 C5.2 C6.2 C7.2 C8.2 C9.2 C100.2 C101.2 C102.2 C103.2 C104.2 C105.2 C106.2 C107.2 C108.2 CA1.2 CA2.- CA3.2 CA4.2 CA5.2 CA6.2 CA7.2 CA8.2 CA9.2 CA10.2 CA11.- CA12.2 CA13.- CA14.- CA15.2 CA16.2 CA17.2 CA18.2 CA19.2 CA20.2 CA22.2 CA23.2 CA24.2 CA25.2 CA26.2 CA27.- CA35.2 CA36.2 CA37.- CA38.2 CA49.- CA50.+ CA51.2 CA54.2 JP9.6 JP11.7 ON.C P1.2 P2.3 P2.5 P4.1 RA9.2 T1.1 T2.1 T3.1 T4.1 T5.1 T6.1 T7.1 T8.1 T9.1 T10.2 T11.2 T12.2 T13.2 T14.1 T15.1 T16.1 T17.1 T18.1 T19.1 T20.1 T21.1 T22.1 T23.1 T24.1 T25.1 T26.2 T27.2 T28.2 T29.2 T30.1 T31.1 T32.1 T33.1 T34.1 T35.1 T36.1 T37.1 T38.1 T39.1 T40.1 T41.1 T42.2 T43.2 T44.2 T45.2 T46.1 T47.1 T48.1 T49.1 T50.1 T51.1 T55.1 T56.1 T57.1 T58.1 T59.1 T60.1 T61.1 T62.2 T63.2 T64.1 T65.2 T66.1 T67.2 T68.1 T69.1 T70.1 T71.1 T72.1 T73.1 T74.1 T75.1 T76.1 T77.1 T78.2 T79.2 T80.1 T81.2 T82.1 T83.2 T84.1 T85.1 T86.1 T87.1 T88.1 T89.1 T90.1 T91.1 T92.1 T93.1 T94.2 T95.2 T96.1 T97.2 T98.1 T99.2 T100.1 T101.2 U4.8(GND) U4.13(OUTPUT_ENABLE) U5.8(GND) U5.13(OUTPUT_ENABLE) U6.8(GND) U6.13(OUTPUT_ENABLE) U7.8(GND) U7.13(OUTPUT_ENABLE) U8.8(GND) U8.13(OUTPUT_ENABLE) U9.8(GND) U9.13(OUTPUT_ENABLE) UA1.12(GND1) UA1.33(GNDPLL) UA1.44(GNDUTMI) UA1.46(JTAGSEL) UA1.54(GNDBU) UA1.58(GND2) UA1.74(GNDANA) UA1.106(GND3) UA1.126(GND4) UU1.12(GND) UU1.27(VSS) UU2.12(GND) UU2.27(VSS) UU3.12(GND) UU3.27(VSS) UU4.12(GND) UU4.27(VSS) UU5.12(GND) UU5.27(VSS) UU6.12(GND) UU6.27(VSS) UUU1.8(GND) UUU1.13(OUTPUT_ENABLE) UUU2.8(GND) UUU2.13(OUTPUT_ENABLE) UUU3.8(GND) UUU3.13(OUTPUT_ENABLE) UUU4.8(GND) UUU4.13(OUTPUT_ENABLE) UUU5.8(GND) UUU5.13(OUTPUT_ENABLE) UUU6.8(GND) UUU6.13(OUTPUT_ENABLE) X1.9(GND) X3.GND Y1.2(GND) Y1.4(GND) Z1.2 Z2.2 Z5.1 ; supply symbol labelled GND
H0: JP4.8 U4.7(QH)
H1: JP4.16 U5.7(QH)
H2: JP5.8 U6.7(QH)
H3: JP5.16 U7.7(QH)
H4: JP6.8 U8.7(QH)
H5: JP6.16 U9.7(QH)
LED1: P4.2 UA1.20(PD7)
LED2: P4.3 UA1.21(PD8)
LED3: P4.4 UA1.1(PB26)
MASTER-RESET: CA21.2 JP9.5 JP11.4 P1.1 UA1.47(NRSTB) X1.1(RESET)
MISO: JP9.1 UA1.108(PA25)
MOSI: JP9.4 UA1.109(PA26)
N$1: UA1.94(PC12)
N$2: JP2.9 UUU4.15(QA)
N$3: ON.A RA3.2
N$4: JP11.5
N$5: JP2.10 UUU4.1(QB)
N$6: JP12.2 UA1.80(PA23)
N$7: RA5.1 UA1.53(FWUP)
N$8: JP12.3 UA1.81(PA22)
N$9: JP12.4 UA1.82(PA6)
N$10: UA1.99(PC17)
N$11: RA7.1 UA1.43(DFSDM)
N$12: RA8.1 UA1.42(DFSDP)
N$13: JP12.6 UA1.84(PA3)
N$14: JP12.7 UA1.85(PA2)
N$15: JP2.11 UUU4.2(QC)
N$16: JP2.12 UUU4.3(QD)
N$17: JP12.1 T102.2 UA1.79(PA24)
N$18: JP2.13 UUU4.4(QE)
N$20: JP12.5 UA1.83(PA4)
N$21: JP2.14 UUU4.5(QF)
N$22: AMPTI.1(OUT) AMPTI.5(+IN) T52.1
N$23: JP2.15 UUU4.6(QG)
N$24: AMPTI.6(-IN) AMPTI.7(OUT) T53.2
N$25: AMPTI.9(-IN) T53.1 T54.2
N$26: AMPTI.8(OUT) AMPTI.12(+IN) T54.1
N$27: JP2.16 UUU4.7(QH)
N$28: JP3.1 UUU5.15(QA)
N$29: JP3.2 UUU5.1(QB)
N$30: JP3.3 UUU5.2(QC)
N$31: JP3.4 UUU5.3(QD)
N$32: JP3.5 UUU5.4(QE)
N$33: JP3.6 UUU5.5(QF)
N$34: JP3.7 UUU5.6(QG)
N$35: JP3.8 UUU5.7(QH)
N$36: JP1.1 UUU1.15(QA)
N$37: JP1.2 UUU1.1(QB)
N$38: JP1.3 UUU1.2(QC)
N$39: JP1.4 UUU1.3(QD)
N$40: JP1.5 UUU1.4(QE)
N$41: JP1.6 UUU1.5(QF)
N$42: JP1.7 UUU1.6(QG)
N$43: JP1.8 UUU1.7(QH)
N$44: JP1.9 UUU2.15(QA)
N$45: JP1.10 UUU2.1(QB)
N$46: JP1.11 UUU2.2(QC)
N$47: JP1.12 UUU2.3(QD)
N$48: JP1.13 UUU2.4(QE)
N$49: JP1.14 UUU2.5(QF)
N$50: JP1.15 UUU2.6(QG)
N$51: JP1.16 UUU2.7(QH)
N$52: JP2.1 UUU3.15(QA)
N$53: JP2.2 UUU3.1(QB)
N$54: JP2.3 UUU3.2(QC)
N$55: JP2.4 UUU3.3(QD)
N$56: JP2.5 UUU3.4(QE)
N$57: JP2.6 UUU3.5(QF)
N$58: JP2.7 UUU3.6(QG)
N$59: JP3.9 UUU6.15(QA)
N$60: JP3.10 UUU6.1(QB)
N$61: JP3.11 UUU6.2(QC)
N$62: JP3.12 UUU6.3(QD)
N$63: JP3.13 UUU6.4(QE)
N$64: JP3.14 UUU6.5(QF)
N$65: JP3.15 UUU6.6(QG)
N$66: JP3.16 UUU6.7(QH)
N$67: JP2.8 UUU3.7(QH)
NC: JP11.3
PULL_DOWN_RESISTOR: JP11.6 RF4.1 X1.3(CH_PD)
RX: JP8.1 UA1.27(PA8)
RXD1: JP11.8 UA1.5(PA12) X1.16(TXD)
RXL: UA1.103(PC30)
SN100: AMPTI.2(-IN) T52.2 UU1.28(D) UU2.28(D) UU3.28(D) UU4.28(D) UU5.28(D) UU6.28(D)
SN1000: AMPTI.13(-IN) AMPTI.14(OUT) T100.2 T101.1 T102.1
SPCK: JP9.3 UA1.110(PA27)
SS3: UA1.142(PB23)
TX: JP8.2 UA1.2(PA9)
TXD1: JP11.1 UA1.6(PA13) X1.15(RXD)
UOTGID: UA1.129(PB11) Z5.2
VBG: CA35.1 RA9.1 UA1.40(VBG)
VDDANA: CA12.1 CA13.+ L1.2 UA1.73(VDDANA)
VDDOUT: CA14.+ CA15.1 CA16.1 CA17.1 CA18.1 CA19.1 CA20.1 L5.1 UA1.10(VDDCORE1) UA1.45(VDDCORE2) UA1.56(VDDOUT) UA1.61(VDDCORE3) UA1.104(VDDCORE4) UA1.124(VDDCORE5)
VDDOUTMI: CA10.1 CA11.+ L2.2 UA1.41(VDDUTMI)
VDDPLL: CA26.1 CA27.+ L5.2 UA1.34(VDDPLL)
XIN: CA24.1 UA1.36(XIN) Y1.1(C1)
XOUT: CA25.1 UA1.35(XOUT) Y1.3(C2)
XUSB [usbvcc]: CA36.1 UA1.39(VBUS) X3.VBUS
Unconnected: U9.9(SQH) UA1.3(PA10) UA1.4(PA11) UA1.7(PA14) UA1.8(PA15) UA1.9(PA17) UA1.13(PD0) UA1.14(PD1) UA1.15(PD2) UA1.16(PD3) UA1.17(PD4) UA1.18(PD5) UA1.19(PD6) UA1.22(PD9) UA1.23(PA0) UA1.24(PA1) UA1.25(PA5) UA1.26(PA7) UA1.28(PB28) UA1.29(PB29) UA1.30(PB30) UA1.31(PB31) UA1.32(PD10) UA1.48(XIN32) UA1.49(XOUT32) UA1.50(SHDN) UA1.51(TST) UA1.55(PC1) UA1.59(PC2) UA1.60(PC3) UA1.63(PC5) UA1.64(PC6) UA1.65(PC7) UA1.66(PC8) UA1.67(PC9) UA1.68(PB27) UA1.69(NRST) UA1.70(PA18) UA1.71(PA19) UA1.72(PA20) UA1.76(PB15) UA1.77(PB16) UA1.88(PB17) UA1.89(PB18) UA1.90(PB19) UA1.91(PB20) UA1.92(PB21) UA1.93(PC11) UA1.95(PC13) UA1.96(PC14) UA1.97(PC15) UA1.98(PC16) UA1.101(PC19) UA1.107(PA21) UA1.113(PB0) UA1.114(PB1) UA1.115(PB2) UA1.116(PC4) UA1.117(PC10) UA1.118(PB3) UA1.119(PB4) UA1.120(PB5) UA1.121(PB6) UA1.122(PB7) UA1.123(PB8) UA1.127(PB9) UA1.128(PB10) UA1.131(PC20) UA1.138(PC27) UA1.140(PB14) UA1.141(PB22) UA1.143(PB24) X1.2(ADC) X1.4(GPIO16) X1.5(GPIO14) X1.6(GPIO12) X1.7(GPIO13) X1.10(GPIO15) X1.11(GPIO2) X1.12(GPIO0) X1.13(GPIO5) X1.14(GPIO4)

## Notes on the sheet
- Amplification Stage | Comunnications Ports
- USB AB
- MISO | +5V
- SPCK | MOSI
- MASTER-RESET | GND
- +3V31 | GND | GND | -5V | +5V
- +3V3F1
- RX | TX | +5V
- LED_3 | LED_2 | LED_1 | GND
- TXD1
- RXD1
- +3V3F | GND
- GND
- TXD1 | TXD1 | +3V3F
- NC | RST_WIFI
- NC | PULL_DOWN_RESISTOR
- GND | RXD1
- ATSAM3X8E
- Sensor's Channels
- N.C. | N.C. - internal pullup
- MISO
- MOSI
- SPCK
- (ETH)
- (SD)
- ERASE
- Yovany Ocampo
- LED3
- Felipe Castaño
- JTAG

## Library data of the parts
AMPTI = SparkFun-AnalogIC:LMV324: Jellybean quad op-amp; PROD_ID: IC-08227
BR1 = bibaja:J: Three terminal jumper made from two 0402, 0603, 0805, etc.
C1-C9 C100-C108 CA1 CA3-CA10 CA12 CA15-CA26 CA28 CA29 CA35 CA36 CA38 CA51 CA54 = rcl:C-US: CAPACITOR, American symbol
CA2 CA11 CA13 CA14 CA27 CA37 CA49 CA50 = rcl:CPOL-US: POLARIZED CAPACITOR, American symbol
ERASE = SmartPrj:MYSMD_PB157
JP1-JP6 JPP1-JPP6 = pinhead:PINHD-2X8: PIN HEADER
JP8 = pinhead:PINHD-1X2: PIN HEADER
JP9 = pinhead:PINHD-2X3: PIN HEADER
JP10 = pinhead:PINHD-1X1: PIN HEADER
JP11 = pinhead:PINHD-2X4: PIN HEADER
JP12 = pinhead:PINHD-1X7: PIN HEADER
L1-L3 L5 = wuerth-elektronik:WE-CBF: SMD EMI Suppression Ferrite Beads - excellent anti-EMI properties - low DCR - impedances till 3000 ohms - rated current up to 6 A
ON = led:LED: LED OSRAM: - CHIPLED LG R971, LG N971, LY N971, LG Q971, LY Q971, LO R971, LY R971 LH N974, LH R974 LS Q976, LO Q976, LY Q976 LO Q996 - Hyper CHIPLED LW Q18S LB Q993, LB Q99A, LB R99A - SideLED LS A670, LO A670, LY A670, LG A670, LP A670 LB A673, LV A673, LT A673, LW A673 LH A674 LY A675 LS A676, LA A676, LO A676, LY A676, LW A676 LS A679, LY A679, LG A679 - Hyper Micro SIDELED® LS Y876, LA Y876, LO Y876, LY Y876 LT Y87S - SmartLED LW L88C, LW L88S LB L89C, LB L89S, LG L890 LS L89K, LO L89K, LY L89K LS L896, LA L896, LO L896, LY L896 - TOPLED LS T670, LO T670, LY T670, LG T670, LP T670 LSG T670, LSP T670, LSY T670, LOP T670, LYG T670 LG T671, LOG T671, LSG T671 LB T673, LV T673, LT T673, LW T673 LH T674 LS T676, LA T676, LO T676, LY T676, LB T676, LH T676, LSB T676, LW T676 LB T67C, LV T67C, LT T67C, LS T67K, LO T67K, LY T67K, LW E67C LS E67B, LA E67B, LO E67B, LY E67B, LB E67C, LV E67C, LT E67C LW T67C LS T679, LY T679, LG T679 LS T770, LO T770, LY T770, LG T770, LP T770 LB T773, LV T773, LT T773, LW T773 LH T774 LS E675, LA E675, LY E675, LS T675 LS T776, LA T776, LO T776, LY T776, LB T776 LHGB T686 LT T68C, LB T68C - Hyper Mini TOPLED® LB M676 - Mini TOPLED Santana® LG M470 LS M47K, LO M47K, LY M47K Source: http://www.osram.convergy.de LUXEON: - LUMILED® LXK2-PW12-R00, LXK2-PW12-S00, LXK2-PW14-U00, LXK2-PW14-V00 LXK2-PM12-R00, LXK2-PM12-S00, LXK2-PM14-U00 LXK2-PE12-Q00, LXK2-PE12-R00, LXK2-PE12-S00, LXK2-PE14-T00, LXK2-PE14-U00 LXK2-PB12-K00, LXK2-PB12-L00, LXK2-PB12-M00, LXK2-PB14-N00, LXK2-PB14-P00, LXK2-PB14-Q00 LXK2-PR12-L00, LXK2-PR12-M00, LXK2-PR14-Q00, LXK2-PR14-R00 LXK2-PD12-Q00, LXK2-PD12-R00, LXK2-PD12-S00 LXK2-PH12-R00, LXK2-PH12-S00 LXK2-PL12-P00, LXK2-PL12-Q00, LXK2-PL12-R00 Source: www.luxeon.com KINGBRIGHT: KA-3528ASYC Source: www.kingbright.com
P1 = jst-ph:JST-PH2
P2 = jst-ph:JST-PH6
P4 = jst-ph:JST-PH4
RA3-RA5 RA7-RA9 RF4 = rcl:R-US_: RESISTOR, American symbol
T1-T102 = rcl:R-EU_: RESISTOR, European symbol
U4-U9 UUU1-UUU6 = MC74HC595ADTR2G:MC74HC595ADTR2G: 8-Bit Serial-Input/Serial or Parallel-Output Shift Register with Latched 3-State Outputs; MPN: MC74HC595ADTR2G; OC_FARNELL: 1607848; OC_NEWARK: 42K0910; PACKAGE: TSSOP-16; SUPPLIER: ON SEMICONDUCTOR
UA1 = SmartPrj:ATSAM3X/A
UU1-UU6 = parts:ADG706: CMOS, +1.8 V to +5.5 V/±2.5 V, 2.5 Ω Low-Voltage, 16-Channel Multiplexer Source: ADG706.pdf; RS: 523-6478
X1 = adafruit:ESP-12
X3 = usb:USB: USB Connectors USB-B-PTH is fully proven SKU : PRT-00139 USB-miniB is fully proven SKU : PRT-00587 USB-A-PCB is untested. USB-A-H is throughly reviewed, but untested. Spark Fun Electronics SKU : PRT-00437 USB-B-SMT is throughly reviewed, but untested. Needs silkscreen touching up. USB-A-S has not been used/tested USB-MB-H has not been used/tested
Y1 = SmartPrj:CRYSTAL-3.2-2.5
Z1 Z2 Z5 = varistor:VARISTOR: VARISTOR

## Net classes
1 USB: width 0.203 mm, drill 0.254 mm, clearance 0.203 mm
2 gnd1: width 0.203 mm, drill 0.254 mm, clearance 0.203 mm
3 usbvcc: width 0.203 mm, drill 0.254 mm, clearance 0.203 mm
4 USBpair: width 0.203 mm, drill 0.254 mm, clearance 0.203 mm
5 UA1: width 0.127 mm, drill 0.254 mm, clearance 0.127 mm